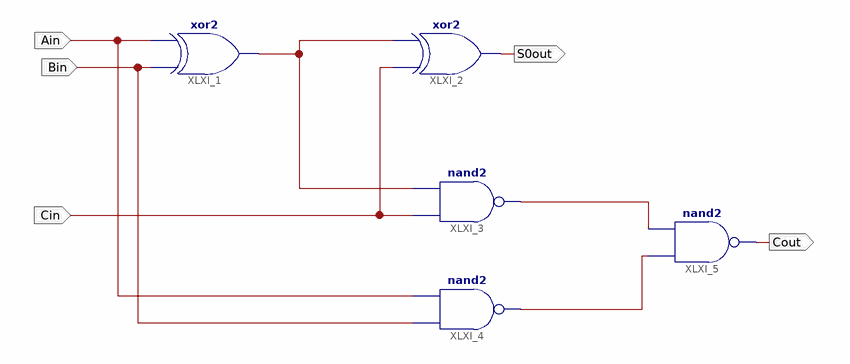
[diagram p0: schematic sheet 1]
// Xilinx ISE schematic FA.sch (spartan3e) as structural Verilog: 5 symbols, 5 ports
module FA (
  input  Bin,
  input  Cin,
  input  Ain,
  output S0out,
  output Cout
);

  wire XLXN_7, XLXN_8, XLXN_9;

  xor XLXI_1 (XLXN_7, Bin, Ain);
  xor XLXI_2 (S0out, Cin, XLXN_7);
  nand XLXI_3 (XLXN_8, Cin, XLXN_7);
  nand XLXI_4 (XLXN_9, Bin, Ain);
  nand XLXI_5 (Cout, XLXN_9, XLXN_8);
endmodule
